# Altium project 388D_Control_v1.PrjPcb (part 1 of 3)
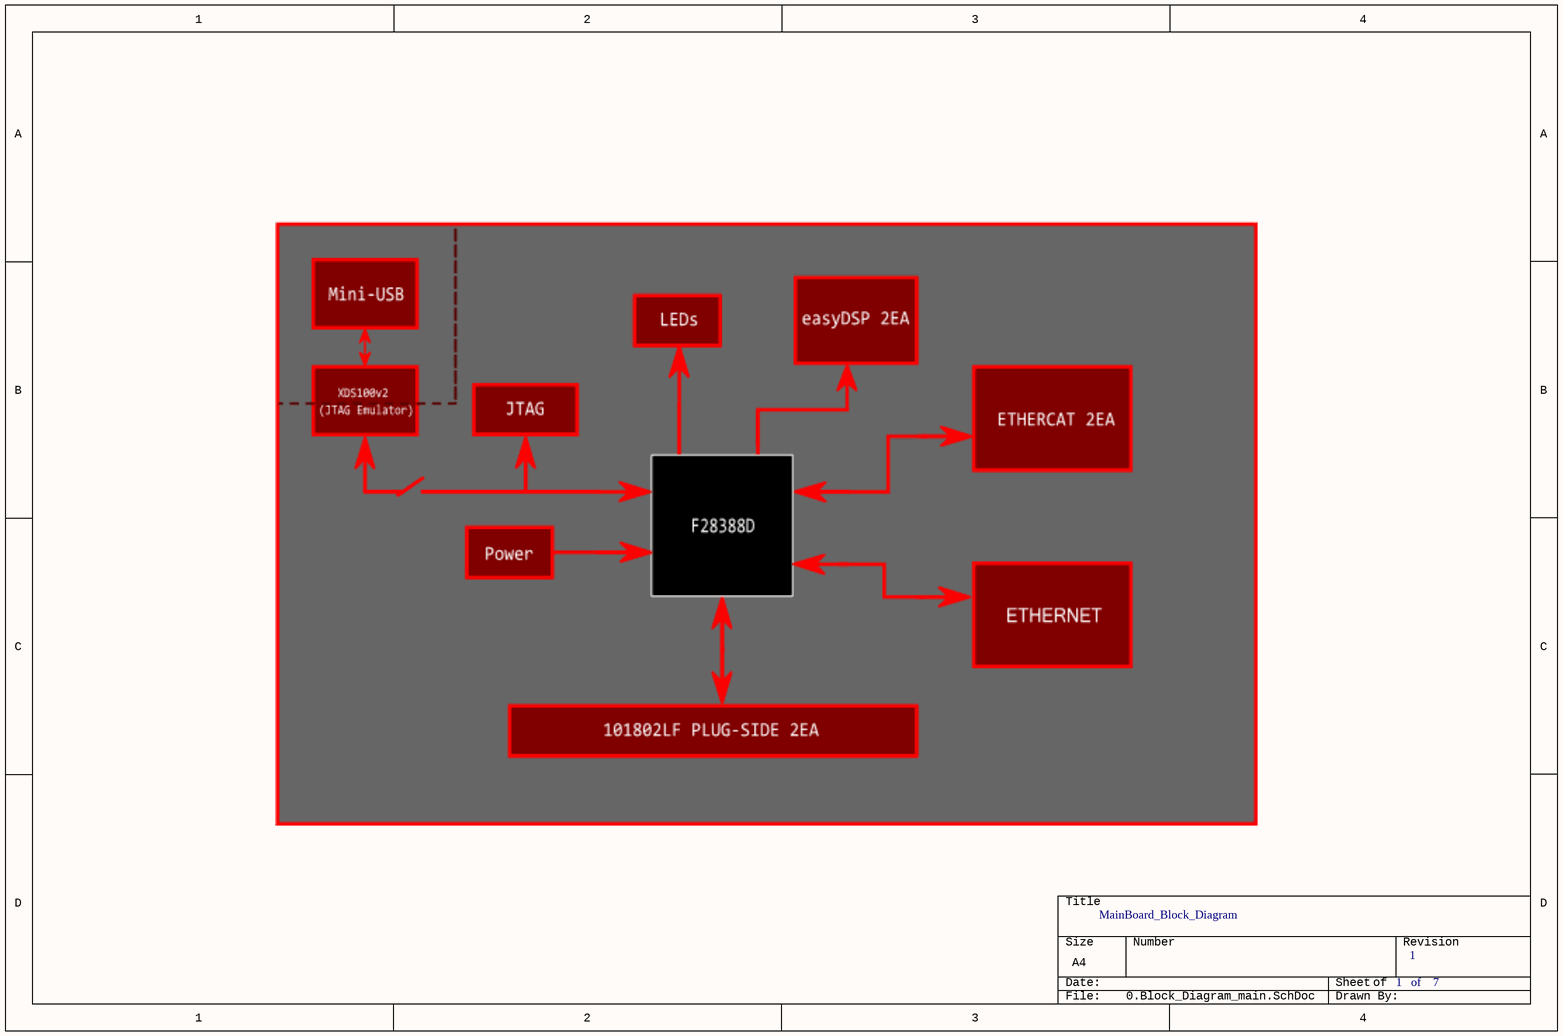
[diagram p0: 0.Block_Diagram_main.SchDoc]
10 sheets, 271 parts. Net scope: global (net labels, ports and power ports of the same name join across sheets).
Board file: 388D_Control_v1_PCB1.PcbDoc
Sheets:
  0.Block_Diagram_main.SchDoc
  1.GPIO.SchDoc
  2.Support.SchDoc
  3.ADC.SchDoc
  4.Power.SchDoc
  5.ETH.SchDoc
  6.ETCAT.SchDoc
  7.Emulator.SchDoc
  8.Emulator_Interface.SchDoc
  9.Pwm_Buffer.SchDoc

## Sheet 0.Block_Diagram_main.SchDoc
size A4; SheetNumber: 1; SheetTotal: 7

### Notes on the sheet
- LEDs
- MainBoard_Block_Diagram
- 1   of    7
- 1

## Sheet 1.GPIO.SchDoc
size A3; SheetNumber: 2; SheetTotal: 10
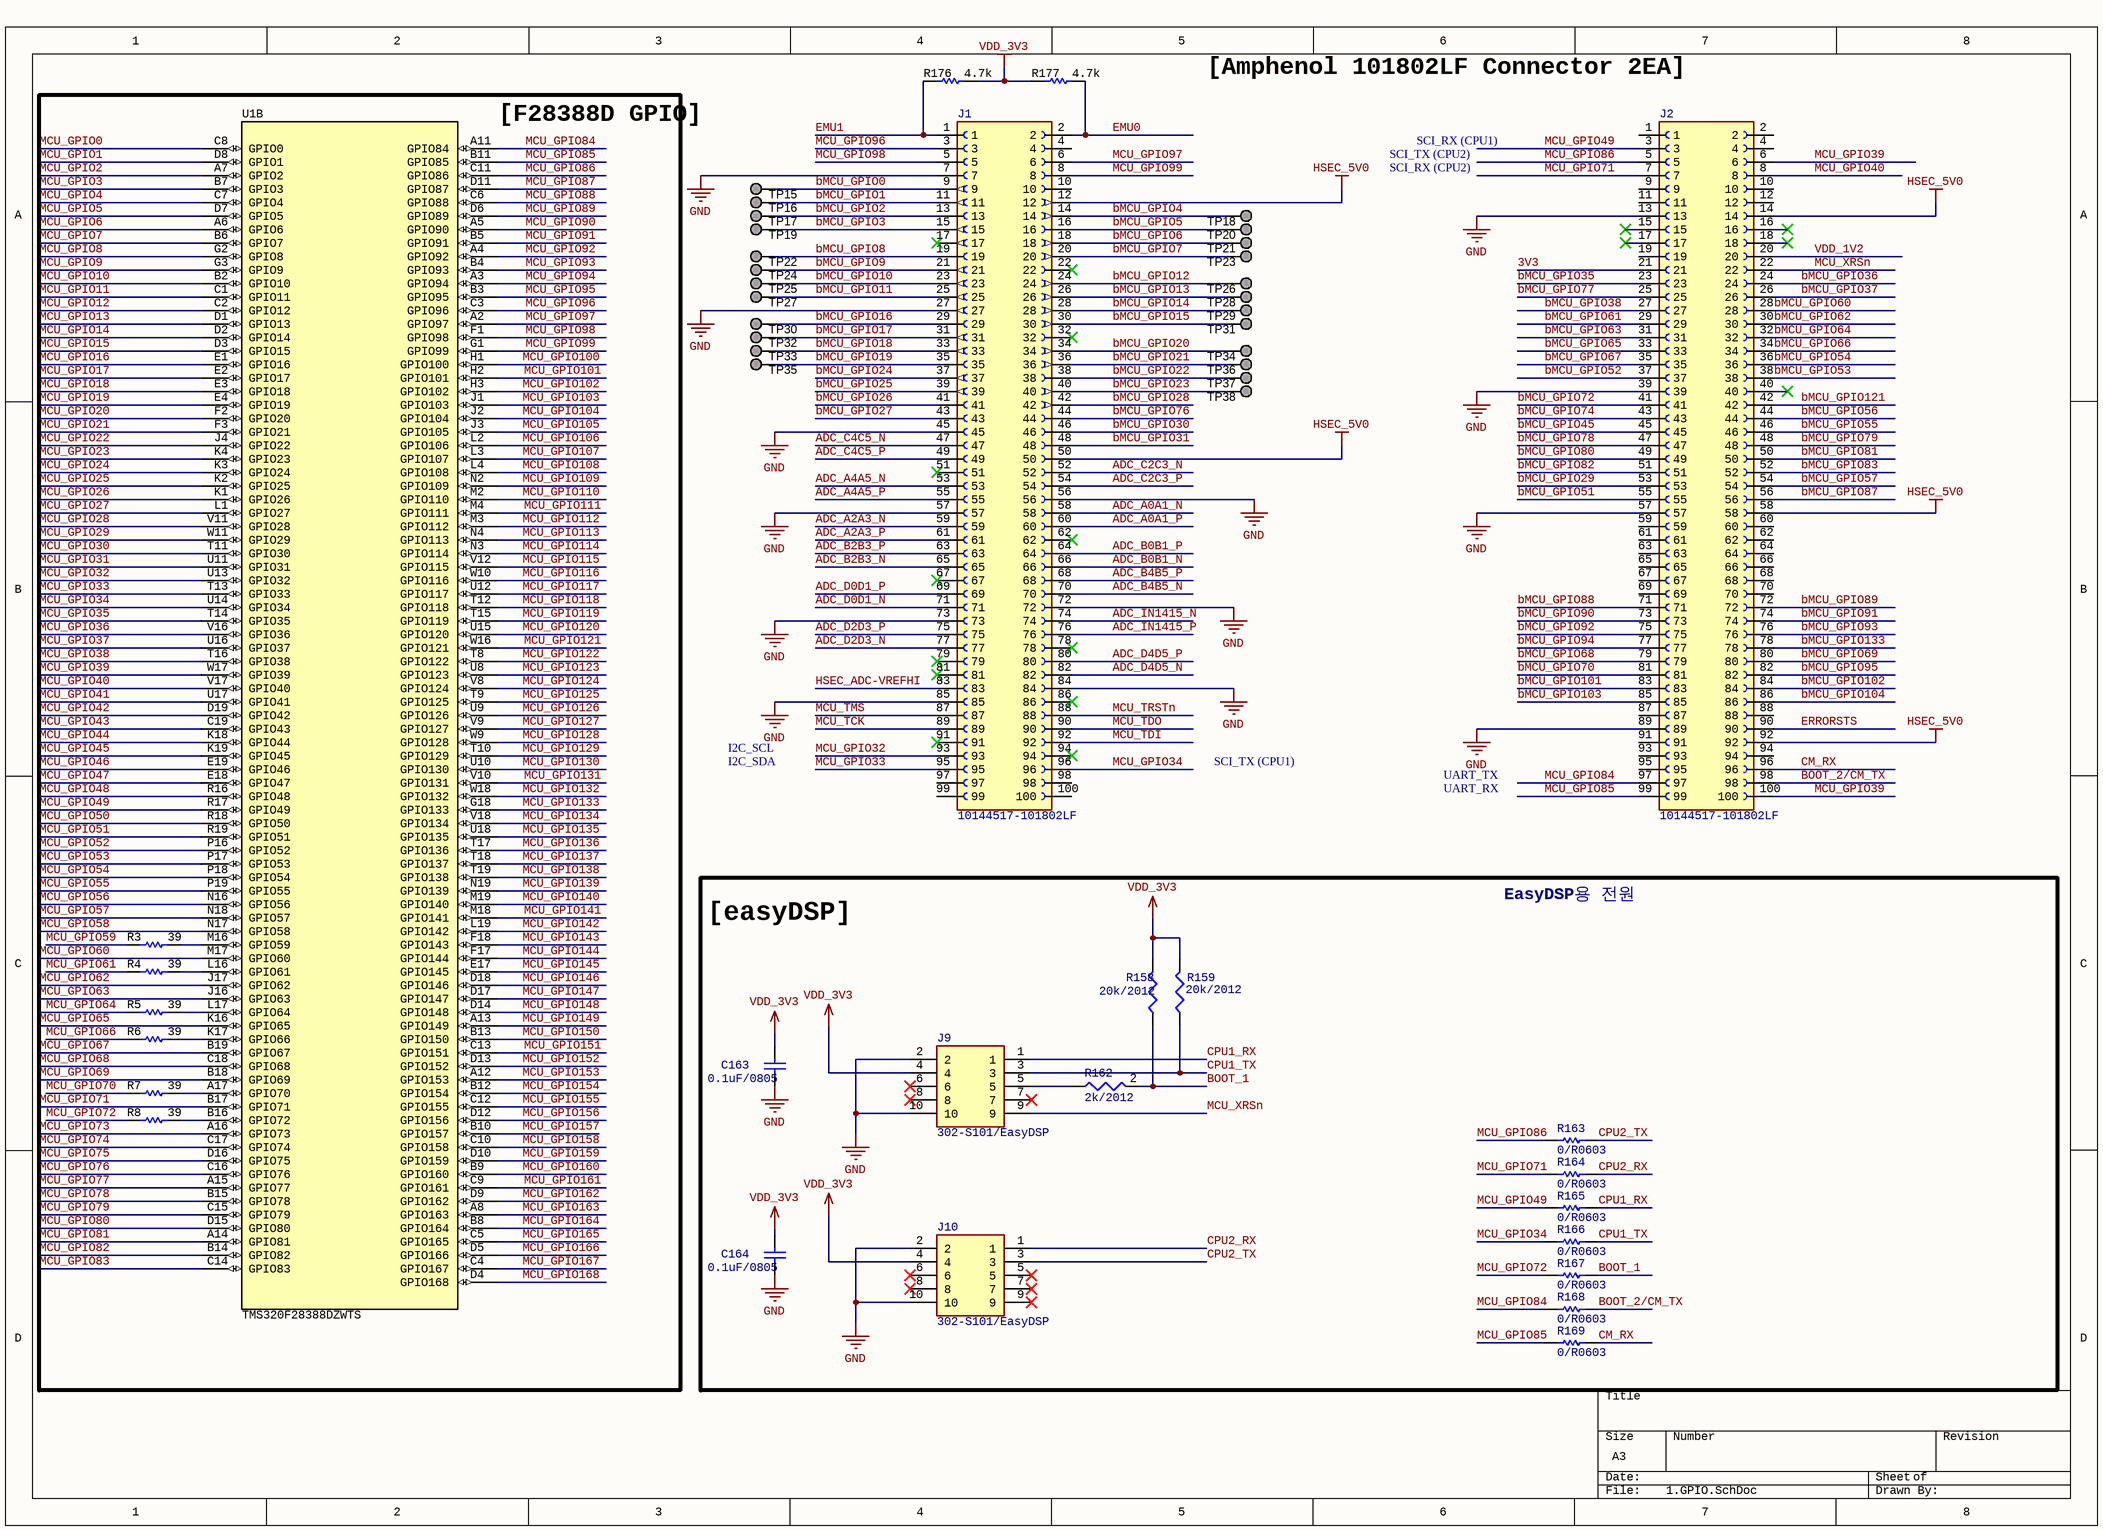
[diagram p1: 1.GPIO.SchDoc]

### Parts
(Parts that share a designator on the sheet are numbered #1, #2 ... from top to bottom, then left to right.)
C163  value 0.1uF/0805  [CAPC2013X135X45NL10T25]  (hidden comment: C2012)
C164  value 0.1uF/0805  [CAPC2013X135X45NL10T25]  (hidden comment: C2012)
J1  10144517-101802LF  [AMPHENOL_10144517-101802LF]
J2  10144517-101802LF  [AMPHENOL_10144517-101802LF]
J9  302-S101/EasyDSP  [SHDR10W66P254_2X5_2030X905X905P]
J10  302-S101/EasyDSP  [SHDR10W66P254_2X5_2030X905X905P]
R3  ValueDisplayed: 39  [0402]  (hidden comment: CRCW040239R0JNED)
R4  ValueDisplayed: 39  [0402]  (hidden comment: CRCW040239R0JNED)
R5  ValueDisplayed: 39  [0402]  (hidden comment: CRCW040239R0JNED)
R6  ValueDisplayed: 39  [0402]  (hidden comment: CRCW040239R0JNED)
R7  ValueDisplayed: 39  [0402]  (hidden comment: CRCW040239R0JNED)
R8  ValueDisplayed: 39  [0402]  (hidden comment: CRCW040239R0JNED)
R158  value 20k/2012  [RESC0805(2012)_L]  (hidden comment: R2012)
R159  value 20k/2012  [RESC0805(2012)_L]  (hidden comment: R2012)
R162  value 2k/2012  [RESC0805(2012)_L]  (hidden comment: R2012)
R163  value 0/R0603  [RESC1608X55X25ML10T15]  (hidden comment: Resistor 0R +/- 5% 0603 100 mW)
R164  value 0/R0603  [RESC1608X55X25ML10T15]  (hidden comment: Resistor 0R +/- 5% 0603 100 mW)
R165  value 0/R0603  [RESC1608X55X25ML10T15]  (hidden comment: Resistor 0R +/- 5% 0603 100 mW)
R166  value 0/R0603  [RESC1608X55X25ML10T15]  (hidden comment: Resistor 0R +/- 5% 0603 100 mW)
R167  value 0/R0603  [RESC1608X55X25ML10T15]  (hidden comment: Resistor 0R +/- 5% 0603 100 mW)
R168  value 0/R0603  [RESC1608X55X25ML10T15]  (hidden comment: Resistor 0R +/- 5% 0603 100 mW)
R169  value 0/R0603  [RESC1608X55X25ML10T15]  (hidden comment: Resistor 0R +/- 5% 0603 100 mW)
R176  ValueDisplayed: 4.7k  [0402]  (hidden comment: CRCW04024K70JNED)
R177  ValueDisplayed: 4.7k  [0402]  (hidden comment: CRCW04024K70JNED)
TP15  TESTPOINT  [TP_50MIL-25MILHOLE]  (value not drawn)  (no BOM)
TP16  TESTPOINT  [TP_50MIL-25MILHOLE]  (value not drawn)  (no BOM)
TP17  TESTPOINT  [TP_50MIL-25MILHOLE]  (value not drawn)  (no BOM)
TP18  TESTPOINT  [TP_50MIL-25MILHOLE]  (value not drawn)  (no BOM)
TP19  TESTPOINT  [TP_50MIL-25MILHOLE]  (value not drawn)  (no BOM)
TP20  TESTPOINT  [TP_50MIL-25MILHOLE]  (value not drawn)  (no BOM)
TP21  TESTPOINT  [TP_50MIL-25MILHOLE]  (value not drawn)  (no BOM)
TP22  TESTPOINT  [TP_50MIL-25MILHOLE]  (value not drawn)  (no BOM)
TP23  TESTPOINT  [TP_50MIL-25MILHOLE]  (value not drawn)  (no BOM)
TP24  TESTPOINT  [TP_50MIL-25MILHOLE]  (value not drawn)  (no BOM)
TP25  TESTPOINT  [TP_50MIL-25MILHOLE]  (value not drawn)  (no BOM)
TP26  TESTPOINT  [TP_50MIL-25MILHOLE]  (value not drawn)  (no BOM)
TP27  TESTPOINT  [TP_50MIL-25MILHOLE]  (value not drawn)  (no BOM)
TP28  TESTPOINT  [TP_50MIL-25MILHOLE]  (value not drawn)  (no BOM)
TP29  TESTPOINT  [TP_50MIL-25MILHOLE]  (value not drawn)  (no BOM)
TP30  TESTPOINT  [TP_50MIL-25MILHOLE]  (value not drawn)  (no BOM)
TP31  TESTPOINT  [TP_50MIL-25MILHOLE]  (value not drawn)  (no BOM)
TP32  TESTPOINT  [TP_50MIL-25MILHOLE]  (value not drawn)  (no BOM)
TP33  TESTPOINT  [TP_50MIL-25MILHOLE]  (value not drawn)  (no BOM)
TP34  TESTPOINT  [TP_50MIL-25MILHOLE]  (value not drawn)  (no BOM)
TP35  TESTPOINT  [TP_50MIL-25MILHOLE]  (value not drawn)  (no BOM)
TP36  TESTPOINT  [TP_50MIL-25MILHOLE]  (value not drawn)  (no BOM)
TP37  TESTPOINT  [TP_50MIL-25MILHOLE]  (value not drawn)  (no BOM)
TP38  TESTPOINT  [TP_50MIL-25MILHOLE]  (value not drawn)  (no BOM)
U1#1  TMS320F28388DZWTS  [ZWT0337A-IPC_B]  (part B of 5)

### Blocks framed on the sheet
[F28388D GPIO]: R3-R8 U1#1
[easyDSP]: C163 C164 J9 J10 R158 R159 R162-R169

### Nets
3V3: J2.21
GND: C163.2 C164.2 J1.7 J1.27 J1.45 J1.56 J1.57 J1.72 J1.73 J1.84 J1.85 J2.13 J2.39 J2.57 J2.89 J9.2 J9.10 J10.2 J10.10
HSEC_5V0: J1.12 J1.50 J2.14 J2.58 J2.92
VDD_1V2: J2.20
VDD_3V3: C163.1 C164.1 J9.4 J10.4 R158.2 R159.2 R176.2 R177.1
ADC_A0A1_N: J1.58
ADC_A0A1_P: J1.60
ADC_A2A3_N: J1.59
ADC_A2A3_P: J1.61
ADC_A4A5_N: J1.53
ADC_A4A5_P: J1.55
ADC_B0B1_N: J1.66
ADC_B0B1_P: J1.64
ADC_B2B3_N: J1.65
ADC_B2B3_P: J1.63
ADC_B4B5_N: J1.70
ADC_B4B5_P: J1.68
ADC_C2C3_N: J1.52
ADC_C2C3_P: J1.54
ADC_C4C5_N: J1.47
ADC_C4C5_P: J1.49
ADC_D0D1_N: J1.71
ADC_D0D1_P: J1.69
ADC_D2D3_N: J1.77
ADC_D2D3_P: J1.75
ADC_D4D5_N: J1.82
ADC_D4D5_P: J1.80
ADC_IN1415_N: J1.74
ADC_IN1415_P: J1.76
bMCU_GPIO0: J1.9 TP15.1
bMCU_GPIO1: J1.11 TP16.1
bMCU_GPIO2: J1.13 TP17.1
bMCU_GPIO3: J1.15 TP19.1
bMCU_GPIO4: J1.14 TP18.1
bMCU_GPIO5: J1.16 TP20.1
bMCU_GPIO6: J1.18 TP21.1
bMCU_GPIO7: J1.20 TP23.1
bMCU_GPIO8: J1.19 TP22.1
bMCU_GPIO9: J1.21 TP24.1
bMCU_GPIO10: J1.23 TP25.1
bMCU_GPIO11: J1.25 TP27.1
bMCU_GPIO12: J1.24 TP26.1
bMCU_GPIO13: J1.26 TP28.1
bMCU_GPIO14: J1.28 TP29.1
bMCU_GPIO15: J1.30 TP31.1
bMCU_GPIO16: J1.29 TP30.1
bMCU_GPIO17: J1.31 TP32.1
bMCU_GPIO18: J1.33 TP33.1
bMCU_GPIO19: J1.35 TP35.1
bMCU_GPIO20: J1.34 TP34.1
bMCU_GPIO21: J1.36 TP36.1
bMCU_GPIO22: J1.38 TP37.1
bMCU_GPIO23: J1.40 TP38.1
bMCU_GPIO24: J1.37
bMCU_GPIO25: J1.39
bMCU_GPIO26: J1.41
bMCU_GPIO27: J1.43
bMCU_GPIO28: J1.42
bMCU_GPIO29: J2.53
bMCU_GPIO30: J1.46
bMCU_GPIO31: J1.48
bMCU_GPIO35: J2.23
bMCU_GPIO36: J2.24
bMCU_GPIO37: J2.26
bMCU_GPIO38: J2.27
bMCU_GPIO45: J2.45
bMCU_GPIO51: J2.55
bMCU_GPIO52: J2.37
bMCU_GPIO53: J2.38
bMCU_GPIO54: J2.36
bMCU_GPIO55: J2.46
bMCU_GPIO56: J2.44
bMCU_GPIO57: J2.54
bMCU_GPIO60: J2.28
bMCU_GPIO61: J2.29
bMCU_GPIO62: J2.30
bMCU_GPIO63: J2.31
bMCU_GPIO64: J2.32
bMCU_GPIO65: J2.33
bMCU_GPIO66: J2.34
bMCU_GPIO67: J2.35
bMCU_GPIO68: J2.79
bMCU_GPIO69: J2.80
bMCU_GPIO70: J2.81
bMCU_GPIO72: J2.41
bMCU_GPIO74: J2.43
bMCU_GPIO76: J1.44
bMCU_GPIO77: J2.25
bMCU_GPIO78: J2.47
bMCU_GPIO79: J2.48
bMCU_GPIO80: J2.49
bMCU_GPIO81: J2.50
bMCU_GPIO82: J2.51
bMCU_GPIO83: J2.52
bMCU_GPIO87: J2.56
bMCU_GPIO88: J2.71
bMCU_GPIO89: J2.72
bMCU_GPIO90: J2.73
bMCU_GPIO91: J2.74
bMCU_GPIO92: J2.75
bMCU_GPIO93: J2.76
bMCU_GPIO94: J2.77
bMCU_GPIO95: J2.82
bMCU_GPIO101: J2.83
bMCU_GPIO102: J2.84
bMCU_GPIO103: J2.85
bMCU_GPIO104: J2.86
bMCU_GPIO121: J2.42
bMCU_GPIO133: J2.78
BOOT_1: R158.1 R162.2 R167.2
BOOT_2/CM_TX: J2.98 R168.2
CM_RX: J2.96 R169.2
CPU1_RX: J9.1 R165.2
CPU1_TX: J9.3 R159.1 R166.2
CPU2_RX: J10.1 R164.2
CPU2_TX: J10.3 R163.2
EMU0: J1.2 R177.2
EMU1: J1.1 R176.1
ERRORSTS: J2.90
HSEC_ADC-VREFHI: J1.83
MCU_GPIO0: U1#1.C8(GPIO0)
MCU_GPIO1: U1#1.D8(GPIO1)
MCU_GPIO2: U1#1.A7(GPIO2)
MCU_GPIO3: U1#1.B7(GPIO3)
MCU_GPIO4: U1#1.C7(GPIO4)
MCU_GPIO5: U1#1.D7(GPIO5)
MCU_GPIO6: U1#1.A6(GPIO6)
MCU_GPIO7: U1#1.B6(GPIO7)
MCU_GPIO8: U1#1.G2(GPIO8)
MCU_GPIO9: U1#1.G3(GPIO9)
MCU_GPIO10: U1#1.B2(GPIO10)
MCU_GPIO11: U1#1.C1(GPIO11)
MCU_GPIO12: U1#1.C2(GPIO12)
MCU_GPIO13: U1#1.D1(GPIO13)
MCU_GPIO14: U1#1.D2(GPIO14)
MCU_GPIO15: U1#1.D3(GPIO15)
MCU_GPIO16: U1#1.E1(GPIO16)
MCU_GPIO17: U1#1.E2(GPIO17)
MCU_GPIO18: U1#1.E3(GPIO18)
MCU_GPIO19: U1#1.E4(GPIO19)
MCU_GPIO20: U1#1.F2(GPIO20)
MCU_GPIO21: U1#1.F3(GPIO21)
MCU_GPIO22: U1#1.J4(GPIO22)
MCU_GPIO23: U1#1.K4(GPIO23)
MCU_GPIO24: U1#1.K3(GPIO24)
MCU_GPIO25: U1#1.K2(GPIO25)
MCU_GPIO26: U1#1.K1(GPIO26)
MCU_GPIO27: U1#1.L1(GPIO27)
MCU_GPIO28: U1#1.V11(GPIO28)
MCU_GPIO29: U1#1.W11(GPIO29)
MCU_GPIO30: U1#1.T11(GPIO30)
MCU_GPIO31: U1#1.U11(GPIO31)
MCU_GPIO32: J1.93 U1#1.U13(GPIO32)
MCU_GPIO33: J1.95 U1#1.T13(GPIO33)
MCU_GPIO34: J1.96 R166.1 U1#1.U14(GPIO34)
MCU_GPIO35: U1#1.T14(GPIO35)
MCU_GPIO36: U1#1.V16(GPIO36)
MCU_GPIO37: U1#1.U16(GPIO37)
MCU_GPIO38: U1#1.T16(GPIO38)
MCU_GPIO39: J2.6 J2.100 U1#1.W17(GPIO39)
MCU_GPIO40: J2.8 U1#1.V17(GPIO40)
MCU_GPIO41: U1#1.U17(GPIO41)
MCU_GPIO42: U1#1.D19(GPIO42)
MCU_GPIO43: U1#1.C19(GPIO43)
MCU_GPIO44: U1#1.K18(GPIO44)
MCU_GPIO45: U1#1.K19(GPIO45)
MCU_GPIO46: U1#1.E19(GPIO46)
MCU_GPIO47: U1#1.E18(GPIO47)
MCU_GPIO48: U1#1.R16(GPIO48)
MCU_GPIO49: J2.3 R165.1 U1#1.R17(GPIO49)
MCU_GPIO50: U1#1.R18(GPIO50)
MCU_GPIO51: U1#1.R19(GPIO51)
MCU_GPIO52: U1#1.P16(GPIO52)
MCU_GPIO53: U1#1.P17(GPIO53)
MCU_GPIO54: U1#1.P18(GPIO54)
MCU_GPIO55: U1#1.P19(GPIO55)
MCU_GPIO56: U1#1.N16(GPIO56)
MCU_GPIO57: U1#1.N18(GPIO57)
MCU_GPIO58: U1#1.N17(GPIO58)
MCU_GPIO59: R3.1
MCU_GPIO60: U1#1.M17(GPIO60)
MCU_GPIO61: R4.1
MCU_GPIO62: U1#1.J17(GPIO62)
MCU_GPIO63: U1#1.J16(GPIO63)
MCU_GPIO64: R5.1
MCU_GPIO65: U1#1.K16(GPIO65)
MCU_GPIO66: R6.1
MCU_GPIO67: U1#1.B19(GPIO67)
MCU_GPIO68: U1#1.C18(GPIO68)
MCU_GPIO69: U1#1.B18(GPIO69)
MCU_GPIO70: R7.1
MCU_GPIO71: J2.7 R164.1 U1#1.B17(GPIO71)
MCU_GPIO72: R8.1 R167.1
MCU_GPIO73: U1#1.A16(GPIO73)
MCU_GPIO74: U1#1.C17(GPIO74)
MCU_GPIO75: U1#1.D16(GPIO75)
MCU_GPIO76: U1#1.C16(GPIO76)
MCU_GPIO77: U1#1.A15(GPIO77)
MCU_GPIO78: U1#1.B15(GPIO78)
MCU_GPIO79: U1#1.C15(GPIO79)
MCU_GPIO80: U1#1.D15(GPIO80)
MCU_GPIO81: U1#1.A14(GPIO81)
MCU_GPIO82: U1#1.B14(GPIO82)
MCU_GPIO83: U1#1.C14(GPIO83)
MCU_GPIO84: J2.97 R168.1 U1#1.A11(GPIO84)
MCU_GPIO85: J2.99 R169.1 U1#1.B11(GPIO85)
MCU_GPIO86: J2.5 R163.1 U1#1.C11(GPIO86)
MCU_GPIO87: U1#1.D11(GPIO87)
MCU_GPIO88: U1#1.C6(GPIO88)
MCU_GPIO89: U1#1.D6(GPIO89)
MCU_GPIO90: U1#1.A5(GPIO90)
MCU_GPIO91: U1#1.B5(GPIO91)
MCU_GPIO92: U1#1.A4(GPIO92)
MCU_GPIO93: U1#1.B4(GPIO93)
MCU_GPIO94: U1#1.A3(GPIO94)
MCU_GPIO95: U1#1.B3(GPIO95)
MCU_GPIO96: J1.3 U1#1.C3(GPIO96)
MCU_GPIO97: J1.6 U1#1.A2(GPIO97)
MCU_GPIO98: J1.5 U1#1.F1(GPIO98)
MCU_GPIO99: J1.8 U1#1.G1(GPIO99)
MCU_GPIO100: U1#1.H1(GPIO100)
MCU_GPIO101: U1#1.H2(GPIO101)
MCU_GPIO102: U1#1.H3(GPIO102)
MCU_GPIO103: U1#1.J1(GPIO103)
MCU_GPIO104: U1#1.J2(GPIO104)
MCU_GPIO105: U1#1.J3(GPIO105)
MCU_GPIO106: U1#1.L2(GPIO106)
MCU_GPIO107: U1#1.L3(GPIO107)
MCU_GPIO108: U1#1.L4(GPIO108)
MCU_GPIO109: U1#1.N2(GPIO109)
MCU_GPIO110: U1#1.M2(GPIO110)
MCU_GPIO111: U1#1.M4(GPIO111)
MCU_GPIO112: U1#1.M3(GPIO112)
MCU_GPIO113: U1#1.N4(GPIO113)
MCU_GPIO114: U1#1.N3(GPIO114)
MCU_GPIO115: U1#1.V12(GPIO115)
MCU_GPIO116: U1#1.W10(GPIO116)
MCU_GPIO117: U1#1.U12(GPIO117)
MCU_GPIO118: U1#1.T12(GPIO118)
MCU_GPIO119: U1#1.T15(GPIO119)
MCU_GPIO120: U1#1.U15(GPIO120)
MCU_GPIO121: U1#1.W16(GPIO121)
MCU_GPIO122: U1#1.T8(GPIO122)
MCU_GPIO123: U1#1.U8(GPIO123)
MCU_GPIO124: U1#1.V8(GPIO124)
MCU_GPIO125: U1#1.T9(GPIO125)
MCU_GPIO126: U1#1.U9(GPIO126)
MCU_GPIO127: U1#1.V9(GPIO127)
MCU_GPIO128: U1#1.W9(GPIO128)
MCU_GPIO129: U1#1.T10(GPIO129)
MCU_GPIO130: U1#1.U10(GPIO130)
MCU_GPIO131: U1#1.V10(GPIO131)
MCU_GPIO132: U1#1.W18(GPIO132)
MCU_GPIO133: U1#1.G18(GPIO133)
MCU_GPIO134: U1#1.V18(GPIO134)
MCU_GPIO135: U1#1.U18(GPIO135)
MCU_GPIO136: U1#1.T17(GPIO136)
MCU_GPIO137: U1#1.T18(GPIO137)
MCU_GPIO138: U1#1.T19(GPIO138)
MCU_GPIO139: U1#1.N19(GPIO139)
MCU_GPIO140: U1#1.M19(GPIO140)
MCU_GPIO141: U1#1.M18(GPIO141)
MCU_GPIO142: U1#1.L19(GPIO142)
MCU_GPIO143: U1#1.F18(GPIO143)
MCU_GPIO144: U1#1.F17(GPIO144)
MCU_GPIO145: U1#1.E17(GPIO145)
MCU_GPIO146: U1#1.D18(GPIO146)
MCU_GPIO147: U1#1.D17(GPIO147)
MCU_GPIO148: U1#1.D14(GPIO148)
MCU_GPIO149: U1#1.A13(GPIO149)
MCU_GPIO150: U1#1.B13(GPIO150)
MCU_GPIO151: U1#1.C13(GPIO151)
MCU_GPIO152: U1#1.D13(GPIO152)
MCU_GPIO153: U1#1.A12(GPIO153)
MCU_GPIO154: U1#1.B12(GPIO154)
MCU_GPIO155: U1#1.C12(GPIO155)
MCU_GPIO156: U1#1.D12(GPIO156)
MCU_GPIO157: U1#1.B10(GPIO157)
MCU_GPIO158: U1#1.C10(GPIO158)
MCU_GPIO159: U1#1.D10(GPIO159)
MCU_GPIO160: U1#1.B9(GPIO160)
MCU_GPIO161: U1#1.C9(GPIO161)
MCU_GPIO162: U1#1.D9(GPIO162)
MCU_GPIO163: U1#1.A8(GPIO163)
MCU_GPIO164: U1#1.B8(GPIO164)
MCU_GPIO165: U1#1.C5(GPIO165)
MCU_GPIO166: U1#1.D5(GPIO166)
MCU_GPIO167: U1#1.C4(GPIO167)
MCU_GPIO168: U1#1.D4(GPIO168)
MCU_TCK: J1.89
MCU_TDI: J1.92
MCU_TDO: J1.90
MCU_TMS: J1.87
MCU_TRSTn: J1.88
MCU_XRSn: J2.22 J9.9
NetJ9_5: J9.5 R162.1
NetR3_2: R3.2 U1#1.M16(GPIO59)
NetR4_2: R4.2 U1#1.L16(GPIO61)
NetR5_2: R5.2 U1#1.L17(GPIO64)
NetR6_2: R6.2 U1#1.K17(GPIO66)
NetR7_2: R7.2 U1#1.A17(GPIO70)
NetR8_2: R8.2 U1#1.B16(GPIO72)

Not connected (* = marked no-connect by the designer): J1 4 10 17* 22* 32* 51* 62* 67* 78* 79* 81* 86* 91* 94* 97 98 99 100; J2 1 2 4 9 10 11 12 15* 16* 17* 18* 19 40* 59 60 61 62 63 64 65 66 67 68 69 70 87 88 91 93 94 95; J9 6* 7* 8*; J10 5* 6* 7* 8* 9*

### Notes on the sheet
- [Amphenol 101802LF Connector 2EA]
- SCI_TX (CPU2)
- SCI_RX (CPU2)
- SCI_RX (CPU1)
- I2C_SCL
- I2C_SDA
- SCI_TX (CPU1)
- UART_RX
- UART_TX
- EasyDSP용 전원

### Library data of the parts
C163 C164 = CMP-001-00007-7: Chip Capacitor, 1 uF, +/- 10%, 50 V, 0805 (2012 Metric); Voltage Rating: 50V; Capacitor Type: Ceramic; Case/Package: 0805; Min Operating Temperature: -55°C; Max Operating Temperature: 125°C; Pins: 2; Tolerance: 10%; RoHS Compliant: True; Mounting Technology: SM
J1 J2 = CMP-002-00178-1: Socket(male) 100 Positions, Dual Row, Vertical Receptacle. BergStak Lite 0.80mm, Board-to-Board Connector,; MF: AMPHENOL ICC / FCI; Source: SamacSys.SchLib; Check_prices: https://www.snapeda.com/parts/10144517-101802LF/Amphenol/view-part/?ref=eda; Value: *; Case/Package: None; MP: 10144517-101802LF; Design Item ID: 10144517-101802LF; SnapEDA_Link: https://www.snapeda.com/parts/10144517-101802LF/Amphenol/view-part/?ref=snap
J9 J10 = CMP-002-00158-1: 10 Positions Header Connector 0.100" (2.54mm) Through Hole Gold; Manufacturer_Name: On Shore Technology Inc.; Design Item ID: 302-S101; Manufacturer_Part_Number: 302-S101; Arrow Part Number: 302-S101; Datasheet Link: https://www.digikey.com/product-detail/en/on-shore-technology-inc/302-S101/ED1543-ND/2178422; Source: SamacSys.SchLib; Arrow Price/Stock: https://www.arrow.com/en/products/302-s101/on-shore-technology?utm_currency=USD&region=nac; Height: 9.05mm
R3-R8 = CMP-0026916-3: RES, 39, 5%, 0.063 W, AEC-Q200 Grade 0, 0402; Manufacturer: Vishay-Dale; Power_W: 63mW; TempCo: 200 ppm/C; Value_Code: 39R0; Value: 39; EIA_Code: E24; SizeX_mm: 1; SizeY_mm: 0.5; SizeZ_mm: 0.6; Value2: 0.063W; AEC Qualified: Y; VDC_V: 50V; AEC Category: Q200; AEC Grade: 0; Supplier Part Number 2: 89M6649; Supplier 2: Newark; Supplier Part Number 3: 71-CRCW0402J-39-E3; Supplier 3: Mouser; RoHS: E; Value1: 5%; MountType: SMT; Supplier 1: Digi-Key; PackageReference: 0402; Tolerance_%: 5%; Res_ohm: 39; SizeArea_mm2: 0.5; CompType: Resistor; PartNumber: CRCW040239R0JNED; ComponentLink1Description: Datasheet link; Supplier Part Number 1: 541-39JCT-ND; Technology: Thick Film; ComponentLink1URL: http://www.vishay.com/docs/20035/dcrcwe3.pdf
R158 R159 R162 = CMP-009-00174-4: Chip Resistor, 4,7 Ohms, +/-5 %, 125 mW, -55 to 155 degC, 0805; Power: 125mW; Tolerance: 5%; Max Operating Temperature: 155°C; Pins: 2; Case/Package: 0805; Min Operating Temperature: -55°C
R163-R169 = CMP-009-00006-5: Chip Resistor, 0 Ohm, 0.1 W, -55 to 155 degC, 0603 (1608 Metric); Power: 100mW; Voltage Rating: 50V; Max Operating Temperature: 155°C; RoHS Compliant: True; Mounting Technology: SM; Case/Package: 0603; Min Operating Temperature: -55°C; Tolerance: 5%; Pins: 2
R176 R177 = CMP-0026938-5: RES, 4.7 k, 5%, 0.063 W, AEC-Q200 Grade 0, 0402; Manufacturer: Vishay-Dale; Power_W: 63mW; TempCo: 200 ppm/C; Value_Code: 4k70; Value: 4.7k; EIA_Code: E24; SizeX_mm: 1; SizeY_mm: 0.5; SizeZ_mm: 0.6; Value2: 0.063W; AEC Qualified: Y; VDC_V: 50V; AEC Category: Q200; AEC Grade: 0; Supplier Part Number 2: 59M6733; Supplier 2: Newark; Supplier Part Number 3: 71-CRCW0402J-4.7K-E3; Supplier 3: Mouser; RoHS: E; Value1: 5%; MountType: SMT; Supplier 1: Digi-Key; PackageReference: 0402; Tolerance_%: 5%; Res_ohm: 4.7k; SizeArea_mm2: 0.5; CompType: Resistor; PartNumber: CRCW04024K70JNED; ComponentLink1Description: Datasheet link; Supplier Part Number 1: 541-4.7KJCT-ND; Technology: Thick Film; ComponentLink1URL: http://www.vishay.com/docs/20035/dcrcwe3.pdf
TP15-TP38 = CMP-0078143-3: TEST POINT.  No entry in BOM.; CompType: Testpoint; PackageReference: N/A; Manufacturer: N/A; PartNumber: N/A; Library Reference: TESTPOINT
U1#1 = CMP-012-000147-1: TMS320F28388DZWTS, ZWT0337A (NFBGA-337); Manufacturer: Texas Instruments; SizeAreaWB_mm2: 324; SizeArea_mm2: 256; AEC Qualified: N; AEC Category: Q200; SizeZ_mm: 1.4; SizeY_mm: 16; CompType: IC; Available Preview Images: 2D; ComponentLink1Description: Datasheet Link; ComponentLink2Description: Product Folder; PackageReference: ZWT0337A; PartNumber: TMS320F28388DZWTS; PackageDescription: NFBGA-337; ComponentLink2URL: http://www.ti.com/product/tms320f28388d; Alternate Manufacturer: Texas Instruments; ComponentLink3URL: http://www.ti.com/product/tms320f28388d/datasheet; ComponentLink1URL: http://www.ti.com/lit/ds/symlink/tms320f28388d.pdf; MountType: SMT; ComponentLink3Description: Online Datasheet; SizeX_mm: 16; Design Item ID: TMS320F28388DZWTS; Source: SamacSys.SchLib

## Sheet 2.Support.SchDoc
size A3; SheetNumber: 3; SheetTotal: 10
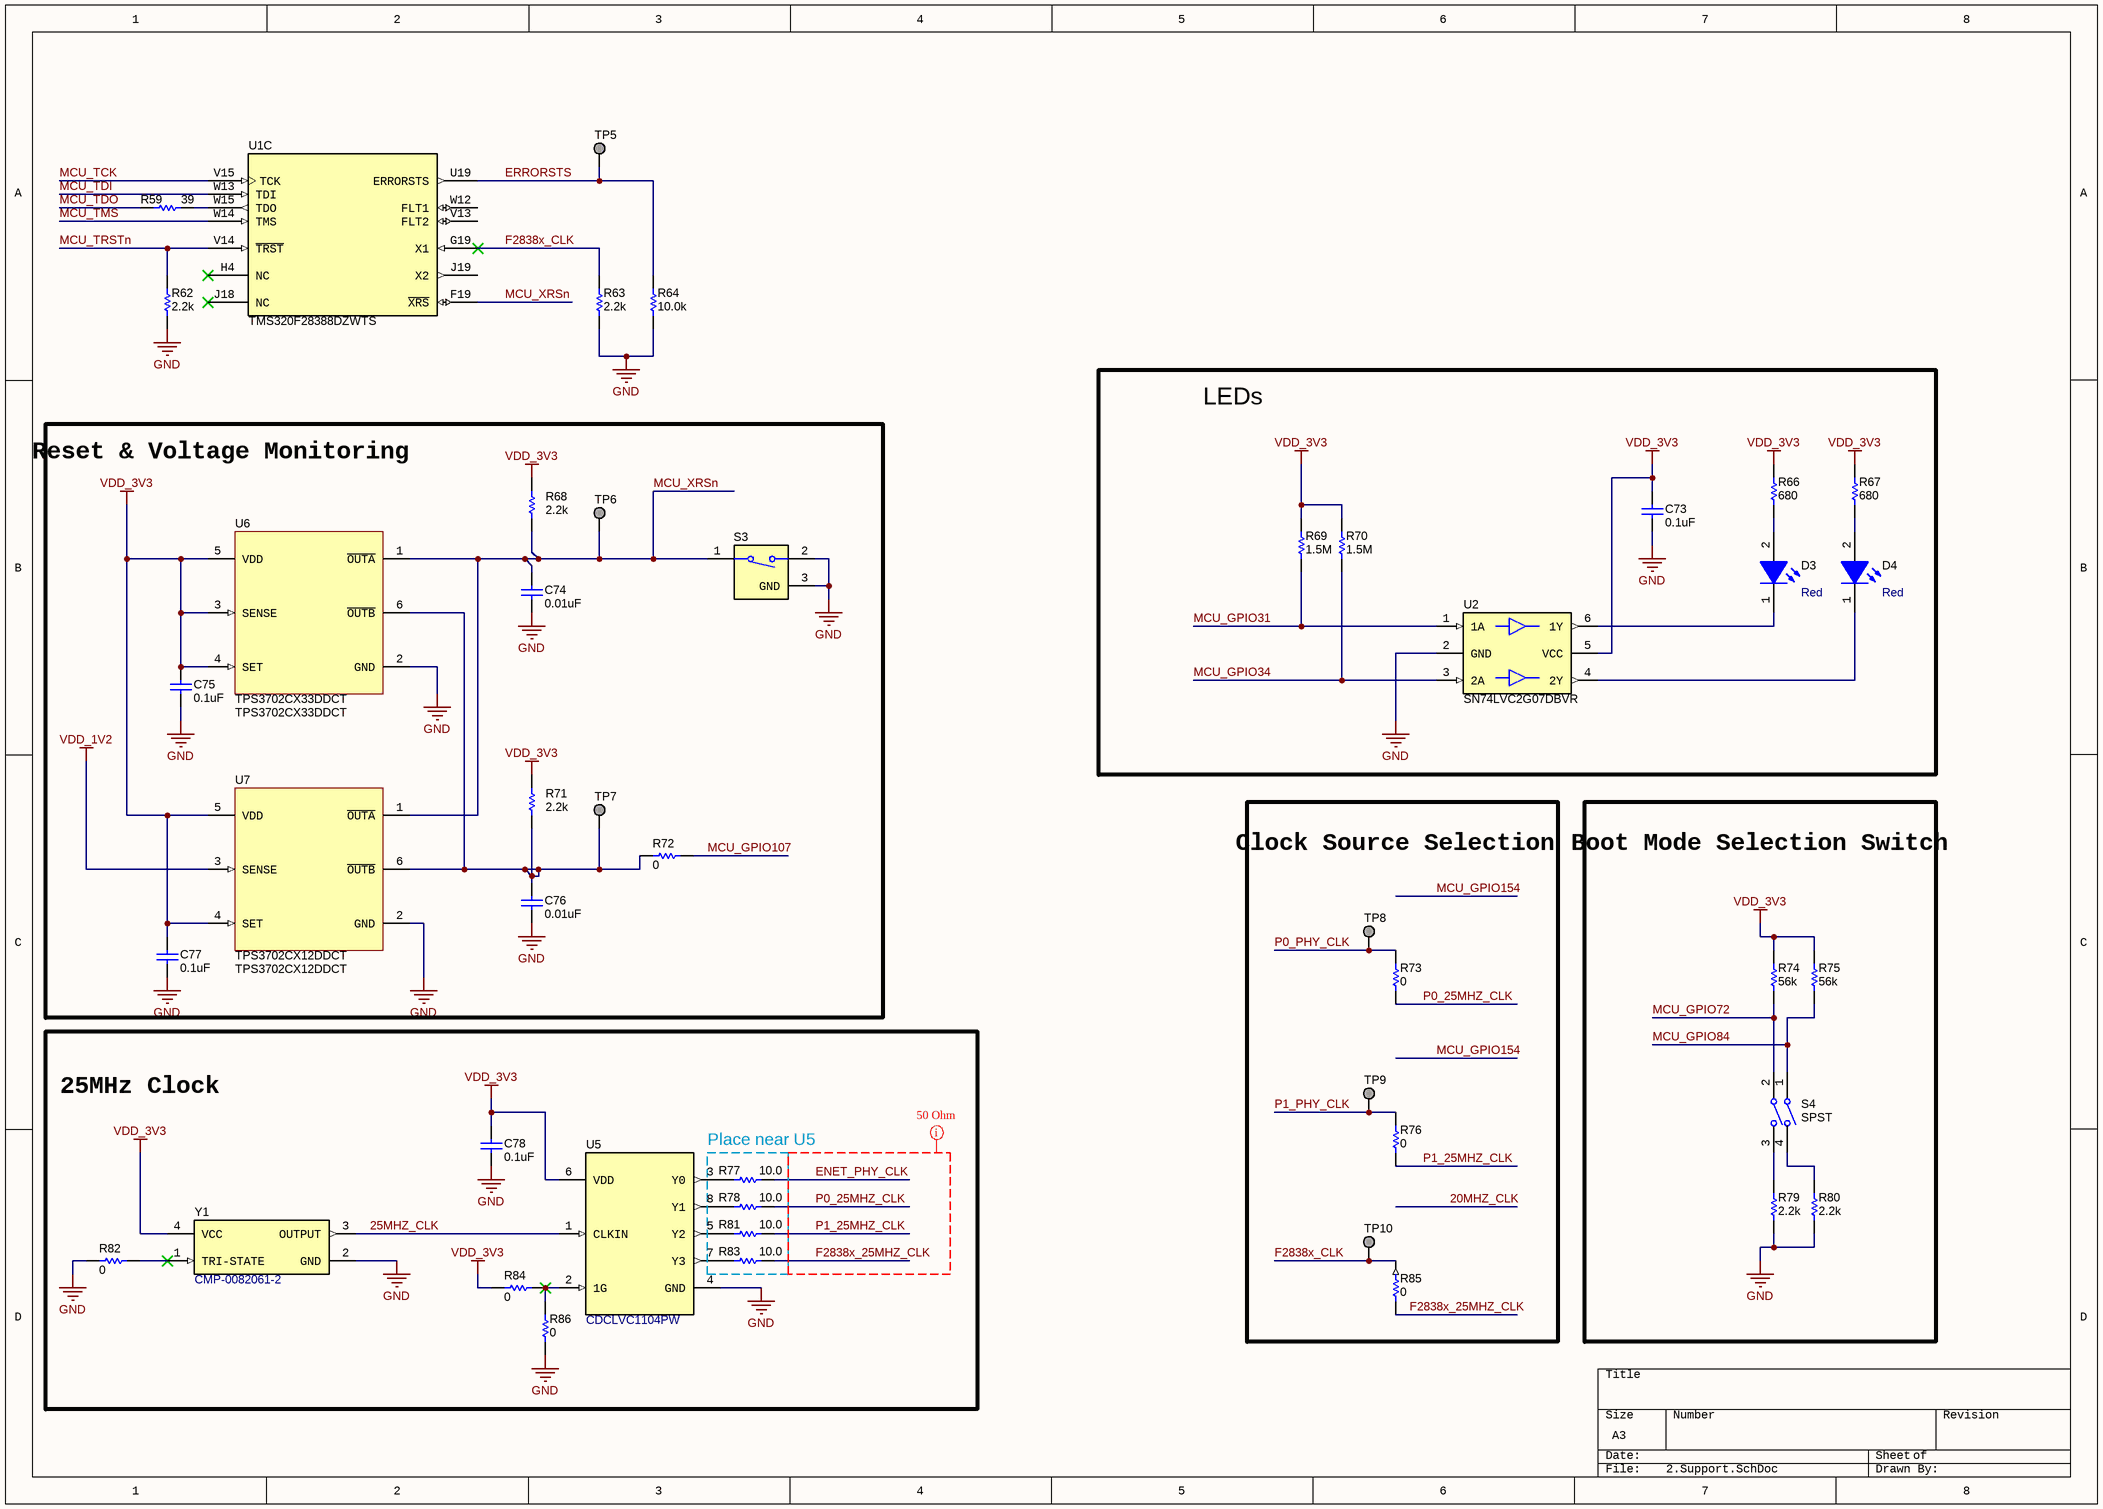
[diagram p2: 2.Support.SchDoc]

### Parts
(Parts that share a designator on the sheet are numbered #1, #2 ... from top to bottom, then left to right.)
C73  ValueDisplayed: 0.1uF  [0402]  (hidden comment: CL05B104KP5NNNC)
C74  ValueDisplayed: 0.01uF  [0402]  (hidden comment: C0402C103J5RACTU)
C75  ValueDisplayed: 0.1uF  [0402]  (hidden comment: CL05B104KP5NNNC)
C76  ValueDisplayed: 0.01uF  [0402]  (hidden comment: C0402C103J5RACTU)
C77  ValueDisplayed: 0.1uF  [0402]  (hidden comment: CL05B104KP5NNNC)
C78  ValueDisplayed: 0.1uF  [0402]  (hidden comment: CL05B104KP5NNNC)
D3  value Red  [WL-SMCW_RED_0805]  (hidden comment: 150080SS75000)
D4  value Red  [WL-SMCW_RED_0805]  (hidden comment: 150080SS75000)
R59  ValueDisplayed: 39  [0402]  (hidden comment: CRCW040239R0JNED)
R62  ValueDisplayed: 2.2k  [0402]  (hidden comment: CRCW04022K20JNED)
R63  ValueDisplayed: 2.2k  [0402]  (hidden comment: CRCW04022K20JNED)
R64  ValueDisplayed: 10.0k  [0402]  (hidden comment: RC0402FR-0710KL)
R66  ValueDisplayed: 680  [0402]  (hidden comment: CRCW0402680RJNED)
R67  ValueDisplayed: 680  [0402]  (hidden comment: CRCW0402680RJNED)
R68  ValueDisplayed: 2.2k  [0402]  (hidden comment: CRCW04022K20JNED)
R69  ValueDisplayed: 1.5M  [0402]  (hidden comment: CRCW04021M50JNED)
R70  ValueDisplayed: 1.5M  [0402]  (hidden comment: CRCW04021M50JNED)
R71  ValueDisplayed: 2.2k  [0402]  (hidden comment: CRCW04022K20JNED)
R72  ValueDisplayed: 0  [0603]  (hidden comment: CRCW06030000Z0EA)
R73  ValueDisplayed: 0  [0603]  (hidden comment: CRCW06030000Z0EA)
R74  ValueDisplayed: 56k  [0402]  (hidden comment: CRCW040256K0JNED)
R75  ValueDisplayed: 56k  [0402]  (hidden comment: CRCW040256K0JNED)
R76  ValueDisplayed: 0  [0603]  (hidden comment: CRCW06030000Z0EA)
R77  ValueDisplayed: 10.0  [CPF0402]  (hidden comment: CPF0402B10RE1)
R78  ValueDisplayed: 10.0  [CPF0402]  (hidden comment: CPF0402B10RE1)
R79  ValueDisplayed: 2.2k  [0402]  (hidden comment: CRCW04022K20JNED)
R80  ValueDisplayed: 2.2k  [0402]  (hidden comment: CRCW04022K20JNED)
R81  ValueDisplayed: 10.0  [CPF0402]  (hidden comment: CPF0402B10RE1)
R82  ValueDisplayed: 0  [0402]  (hidden comment: CRCW04020000Z0EDHP)
R83  ValueDisplayed: 10.0  [CPF0402]  (hidden comment: CPF0402B10RE1)
R84  ValueDisplayed: 0  [0402]  (hidden comment: CRCW04020000Z0EDHP)
R85  ValueDisplayed: 0  [0603]  (hidden comment: CRCW06030000Z0EA)
R86  ValueDisplayed: 0  [0402]  (hidden comment: CRCW04020000Z0EDHP)
S3  B3U-1100P  [SW_B3U-1100P]  (value not drawn)
S4  Circuit: SPST  [SW_218-2LP]  (hidden comment: 218-2LPST)
TP5  TESTPOINT  [TP_50MIL-25MILHOLE]  (value not drawn)  (no BOM)
TP6  TESTPOINT  [TP_50MIL-25MILHOLE]  (value not drawn)  (no BOM)
TP7  TESTPOINT  [TP_50MIL-25MILHOLE]  (value not drawn)  (no BOM)
TP8  TESTPOINT  [TP_50MIL-25MILHOLE]  (value not drawn)  (no BOM)
TP9  TESTPOINT  [TP_50MIL-25MILHOLE]  (value not drawn)  (no BOM)
TP10  TESTPOINT  [TP_50MIL-25MILHOLE]  (value not drawn)  (no BOM)
U1#1  TMS320F28388DZWTS  [ZWT0337A-IPC_B]  (part C of 5)
U2  SN74LVC2G07DBVR  [DBV0006A_N]
U5  CDCLVC1104PW  [PW0008A_N]
U6  TPS3702CX33DDCT  [DDC0006A_N]
U7  TPS3702CX12DDCT  [DDC0006A_N]
Y1  CMP-0082061-2  [ECS_ECS-2520S]

### Blocks framed on the sheet
LEDs: C73 D3 D4 R66 R67 R69 R70 U2
Reset & Voltage Monitoring: C74-C77 R68 R71 R72 S3 TP6 TP7 U6 U7
Clock Source Selection: R73 R76 R85 TP8-TP10
Boot Mode Selection Switch: R74 R75 R79 R80 S4
25MHz Clock: C78 R77 R78 R81-R84 R86 U5 Y1

### Nets
GND: C73.2 C74.2 C75.2 C76.2 C77.2 C78.2 R62.1 R63.1 R64.1 R79.2 R80.1 R82.2 R86.2 S3.2 S3.3(GND) U2.2(GND) U5.4(GND) U6.2(GND) U7.2(GND) Y1.2(GND)
VDD_1V2: U7.3(SENSE)
VDD_3V3: C73.1 C75.1 C77.1 C78.1 R66.1 R67.1 R68.2 R69.2 R70.2 R71.2 R74.1 R75.2 R84.1 U2.5(VCC) U5.6(VDD) U6.3(SENSE) U6.4(SET) U6.5(VDD) U7.4(SET) U7.5(VDD) Y1.4(VCC)
25MHZ_CLK: U5.1(CLKIN) Y1.3(OUTPUT)
ENET_PHY_CLK: R77.2
ERRORSTS: R64.2 TP5.1 U1#1.U19(ERRORSTS)
F2838x_25MHZ_CLK: R83.2 R85.2
F2838x_CLK: R63.2 R85.1 TP10.1 U1#1.G19(X1)
MCU_GPIO31: R69.1 U2.1(1A)
MCU_GPIO34: R70.1 U2.3(2A)
MCU_GPIO72: R74.2 S4.2
MCU_GPIO84: R75.1 S4.1
MCU_GPIO107: R72.2
MCU_TCK: U1#1.V15(TCK)
MCU_TDI: U1#1.W13(TDI)
MCU_TDO: R59.1
MCU_TMS: U1#1.W14(TMS)
MCU_TRSTn: R62.2 U1#1.V14(~{TRST})
MCU_XRSn: C74.1 R68.1 S3.1 TP6.1 U1#1.F19(~{XRS}) U6.1(~{OUTA}) U7.1(~{OUTA})
P0_25MHZ_CLK: R73.2 R78.2
P0_PHY_CLK: R73.1 TP8.1
P1_25MHZ_CLK: R76.2 R81.2
P1_PHY_CLK: R76.1 TP9.1
NetC76_1: C76.1 R71.1 R72.1 TP7.1 U6.6(~{OUTB}) U7.6(~{OUTB})
NetD3_1: D3.1(K) U2.6(1Y)
NetD3_2: D3.2(A) R66.2
NetD4_1: D4.1(K) U2.4(2Y)
NetD4_2: D4.2(A) R67.2
NetR59_2: R59.2 U1#1.W15(TDO)
NetR77_1: R77.1 U5.3(Y0)
NetR78_1: R78.1 U5.8(Y1)
NetR79_1: R79.1 S4.3
NetR80_2: R80.2 S4.4
NetR81_1: R81.1 U5.5(Y2)
NetR82_1: R82.1 Y1.1(TRI-STATE)
NetR83_1: R83.1 U5.7(Y3)
NetR84_2: R84.2 R86.1 U5.2(1G)

Not connected (* = marked no-connect by the designer): U1#1 H4(NC)* J18(NC)* J19(X2) V13(FLT2) W12(FLT1)

### Layout directives
50 Ohm Impedance: Undefined: ENET_PHY_CLK, F2838x_25MHZ_CLK, P0_25MHZ_CLK, P1_25MHZ_CLK

### Notes on the sheet
- Place near U5

### Library data of the parts
C73 C75 C77 C78 = CMP-0006343-2: CAP, CERM, 0.1 uF, 10 V, +/- 10%, X7R, 0402; Manufacturer: Samsung Electro-Mechanics; Polarized: N; Value: 0.1uF; U/M: EA; Cap_F: 100nF; Value1: Unknown; VDC_V: 10V; TaMin_C: -55°C; TaMax_C: 125°C; AEC Category: Q200; SizeArea_mm2: 0.5; SizeAreaWB_mm2: 3; SizeX_mm: 1; SizeZ_mm: 0.6; CompType: Capacitor; PartNumber: CL05B104KP5NNNC; PackageReference: 0402; RoHS: Y; Tolerance_%: 10%; Value2: 10V; MountType: SMT; Technology: Ceramic; TempCo: X7R; Cap_Case: 0402; Published: 2008-06-19; Publisher: Texas Instruments; LatestRevisionDate: 2017-03-09; ComponentLink1Description: Datasheet link; ComponentLink1URL: http://www.samsungsem.com/kr/front/downloadcms.do?path=/kr/support/product-search/mlcc/__icsFiles/afieldfile/2014/11/05&fileName=S_CL05B104KP5NNNC.pdf; AEC Qualified: N; AEC Grade: N/A; SizeY_mm: 0.5
C74 C76 = CMP-0006236-2: CAP, CERM, 0.01 uF, 50 V, +/- 5%, X7R, 0402; Manufacturer: Kemet; TaMin_C: -55°C; Polarized: N; SizeAreaWB_mm2: 3; Value1: Unknown; U/M: EA; Value: 0.01uF; TaMax_C: 125°C; SizeZ_mm: 0.6; SizeX_mm: 1; SizeY_mm: 0.5; Value2: 50V; Cap_F: 10nF; AEC Category: Q200; Supplier Part Number 2: 57J0044; Publisher: Texas Instruments; Supplier 2: Newark; Supplier Part Number 3: 80-C0402C103J5R; TempCo: X7R; Supplier 3: Mouser; Published: 2008-06-19; RoHS: Y; MountType: SMT; Supplier 1: Digi-Key; PackageReference: 0402; Tolerance_%: 5%; Cap_Case: 0402; SizeArea_mm2: 0.5; CompType: Capacitor; LatestRevisionDate: 2017-03-09; PartNumber: C0402C103J5RACTU; AEC Qualified: ?; ComponentLink1Description: Datasheet link; Supplier Part Number 1: 399-7758-1-ND; Technology: Ceramic; ComponentLink1URL: http://www.kemet.com/Lists/ProductCatalog/Attachments/53/KEM_C1002_X7R_SMD.pdf
D3 = CMP-0002951-3: LED, Red, SMD; Manufacturer: Wurth Elektronik; Type: AlInGaP; Angle: 140; Vr_V: 5V; Ir_A: 25µA; Vf_V: 1.9V; Value1: 0.072W; Tjmax_C: 85°C; Io_A: 30mA; Power_TotalModule: 72mW; CompType: LED; PartNumber: 150080SS75000; Color: Red; MountType: SMT; ComponentLink1URL: http://katalog.we-online.de/led/datasheet/150080SS75000.pdf; PackageReference: LED_0805; ComponentLink1Description: Datasheet link; Value2: 1.9V; RoHS: Y
D4 = CMP-0002951-3: LED, Red, SMD; Manufacturer: Wurth Elektronik; Type: AlInGaP; Vf_V: 1.9V; Io_A: 30mA; Vr_V: 5V; Ir_A: 25µA; Tjmax_C: 85°C; Power_TotalModule: 72mW; Value1: 0.072W; Angle: 140; PartNumber: 150080SS75000; PackageReference: LED_0805; RoHS: Y; CompType: LED; MountType: SMT; Value2: 1.9V; Color: Red; ComponentLink1URL: http://katalog.we-online.de/led/datasheet/150080SS75000.pdf; ComponentLink1Description: Datasheet link
R59 = CMP-0026916-3: as R3 on sheet 1.GPIO; Supplier Part Number 2: 89M6649; Supplier 2: Newark; Supplier Part Number 3: 71-CRCW0402J-39-E3; Supplier 3: Mouser; RoHS: E; Value1: 5%; MountType: SMT; Supplier 1: Digi-Key; PackageReference: 0402; Tolerance_%: 5%; Res_ohm: 39; SizeArea_mm2: 0.5; CompType: Resistor; PartNumber: CRCW040239R0JNED; ComponentLink1Description: Datasheet link; Supplier Part Number 1: 541-39JCT-ND; Technology: Thick Film; ComponentLink1URL: http://www.vishay.com/docs/20035/dcrcwe3.pdf
R62 R63 = CMP-0026890-5: RES, 2.2 k, 5%, 0.063 W, AEC-Q200 Grade 0, 0402; Manufacturer: Vishay-Dale; Power_W: 63mW; TempCo: 200 ppm/C; Value_Code: 2k20; Value: 2.2k; EIA_Code: E24; SizeX_mm: 1; SizeY_mm: 0.5; SizeZ_mm: 0.6; Value2: 0.063W; AEC Qualified: Y; VDC_V: 50V; AEC Category: Q200; AEC Grade: 0; Supplier Part Number 2: 59M6710; Supplier 2: Newark; Supplier Part Number 3: 71-CRCW0402J-2.2K-E3; Supplier 3: Mouser; RoHS: E; Value1: 5%; MountType: SMT; Supplier 1: Digi-Key; PackageReference: 0402; Tolerance_%: 5%; Res_ohm: 2.2k; SizeArea_mm2: 0.5; CompType: Resistor; PartNumber: CRCW04022K20JNED; ComponentLink1Description: Datasheet link; Supplier Part Number 1: 541-2.2KJCT-ND; Technology: Thick Film; ComponentLink1URL: http://www.vishay.com/docs/20035/dcrcwe3.pdf
R64 = CMP-0078669-1: RES, 10.0 k, 1%, 0.063 W, 0402; Manufacturer: Yageo America; Power_W: 63mW; Green_Lifecycle: Active; TempCo: 100 ppm/C; Value_Code: 10k0; Green_REACh: Passed; Value: 10.0k; EIA_Code: E96; Res_ohm: 10k; SizeX_mm: 1; SizeY_mm: 0.5; SizeZ_mm: 0.6; Value2: 0.063W; AEC Qualified: N; AEC Category: Q200; ComponentLink1URL: http://www.yageo.com/documents/recent/PYu-RC_Group_51_RoHS_L_8.pdf; Supplier Part Number 2: 98K7499; Supplier 2: Newark; Supplier Part Number 3: 603-RC0402FR-0710KL; Supplier 3: Mouser; RoHS: Y; Value1: 1%; MountType: SMT; Green_EU RoHS-2: Passed; Supplier 1: Digi-Key; Green_EU RoHS: Passed with Exemption; PackageReference: 0402; Tolerance_%: 1%; SizeArea_mm2: 0.5; CompType: Resistor; PartNumber: RC0402FR-0710KL; ComponentLink1Description: Datasheet link; AEC Grade: N/A; Supplier Part Number 1: 311-10.0KLRCT-ND; Technology: Thick Film
R66 R67 = CMP-0026962-3: RES, 680, 5%, 0.063 W, AEC-Q200 Grade 0, 0402; Manufacturer: Vishay-Dale; Value: 680; Value_Code: 680R; Power_W: 63mW; Value2: 0.063W; VDC_V: 50V; TempCo: 200 ppm/C; EIA_Code: E24; AEC Category: Q200; AEC Qualified: Y; AEC Grade: 0; SizeArea_mm2: 0.5; SizeX_mm: 1; SizeZ_mm: 0.6; CompType: Resistor; PartNumber: CRCW0402680RJNED; PackageReference: 0402; RoHS: E; Res_ohm: 680; Tolerance_%: 5%; Value1: 5%; MountType: SMT; Technology: Thick Film; ComponentLink1Description: Datasheet link; ComponentLink1URL: http://www.vishay.com/docs/20035/dcrcwe3.pdf; Supplier 1: Digi-Key; Supplier Part Number 1: 541-680JCT-ND; Supplier 2: Newark; Supplier Part Number 2: 59M6744; Supplier 3: Mouser; Supplier Part Number 3: 71-CRCW0402J-680-E3; SizeY_mm: 0.5
R68 R71 R79 R80 = CMP-0026890-5: RES, 2.2 k, 5%, 0.063 W, AEC-Q200 Grade 0, 0402; Manufacturer: Vishay-Dale; Value: 2.2k; Value_Code: 2k20; Power_W: 63mW; Value2: 0.063W; VDC_V: 50V; TempCo: 200 ppm/C; EIA_Code: E24; AEC Category: Q200; AEC Qualified: Y; AEC Grade: 0; SizeArea_mm2: 0.5; SizeX_mm: 1; SizeZ_mm: 0.6; CompType: Resistor; PartNumber: CRCW04022K20JNED; PackageReference: 0402; RoHS: E; Res_ohm: 2.2k; Tolerance_%: 5%; Value1: 5%; MountType: SMT; Technology: Thick Film; ComponentLink1Description: Datasheet link; ComponentLink1URL: http://www.vishay.com/docs/20035/dcrcwe3.pdf; Supplier 1: Digi-Key; Supplier Part Number 1: 541-2.2KJCT-ND; Supplier 2: Newark; Supplier Part Number 2: 59M6710; Supplier 3: Mouser; Supplier Part Number 3: 71-CRCW0402J-2.2K-E3; SizeY_mm: 0.5
R69 R70 = CMP-0026863-2: RES, 1.5 M, 5%, 0.063 W, AEC-Q200 Grade 0, 0402; Manufacturer: Vishay-Dale; Power_W: 63mW; TempCo: 200 ppm/C; Value_Code: 1M50; Value: 1.5Meg; EIA_Code: E24; SizeX_mm: 1; SizeY_mm: 0.5; SizeZ_mm: 0.6; Value2: 0.063W; AEC Qualified: Y; VDC_V: 50V; AEC Category: Q200; AEC Grade: 0; ComponentLink1URL: http://www.vishay.com/docs/20035/dcrcwe3.pdf; Supplier Part Number 2: 71-CRCW04021M50JNED; Supplier 2: Mouser; RoHS: E; Value1: 5%; MountType: SMT; Supplier 1: Digi-Key; PackageReference: 0402; Tolerance_%: 5%; Res_ohm: 1.5M; SizeArea_mm2: 0.5; CompType: Resistor; PartNumber: CRCW04021M50JNED; ComponentLink1Description: Datasheet link; Supplier Part Number 1: 541-1.5MJCT-ND; Technology: Thick Film
R72 R73 R76 R85 = CMP-0025697-4: RES, 0, 5%, 0.1 W, AEC-Q200 Grade 0, 0603; Manufacturer: Vishay-Dale; Value: 0; Value_Code: 0000; Power_W: 100mW; Value2: 0.1W; VDC_V: 75V; TempCo: 200 ppm/C; EIA_Code: E24; AEC Category: Q200; AEC Qualified: Y; SizeArea_mm2: 1.28; SizeX_mm: 1.6; SizeY_mm: 0.8; SizeZ_mm: 1; CompType: Resistor; PartNumber: CRCW06030000Z0EA; PackageReference: 0603; RoHS: E; Res_ohm: 0; Tolerance_%: 5%; Value1: 5%; MountType: SMT; Technology: Thick Film; ComponentLink1Description: Datasheet link; ComponentLink1URL: http://www.vishay.com/docs/20035/dcrcwe3.pdf; Supplier 1: Digi-Key; Supplier Part Number 1: 541-0.0GCT-ND; Supplier 2: Newark; Supplier Part Number 2: 52K8014; Supplier 3: Mouser; Supplier Part Number 3: 71-CRCW0603-0-E3; AEC Grade: 0
R74 R75 = CMP-0026949-3: RES, 56 k, 5%, 0.063 W, AEC-Q200 Grade 0, 0402; Manufacturer: Vishay-Dale; Value: 56k; Value_Code: 56k0; Power_W: 63mW; Value2: 0.063W; VDC_V: 50V; TempCo: 200 ppm/C; EIA_Code: E24; AEC Category: Q200; AEC Qualified: Y; AEC Grade: 0; SizeArea_mm2: 0.5; SizeX_mm: 1; SizeZ_mm: 0.6; CompType: Resistor; PartNumber: CRCW040256K0JNED; PackageReference: 0402; RoHS: E; Res_ohm: 56k; Tolerance_%: 5%; Value1: 5%; MountType: SMT; Technology: Thick Film; ComponentLink1Description: Datasheet link; ComponentLink1URL: http://www.vishay.com/docs/20035/dcrcwe3.pdf; Supplier 1: Digi-Key; Supplier Part Number 1: 541-56KJCT-ND; Supplier 2: Newark; Supplier Part Number 2: 89M6680; Supplier 3: Mouser; Supplier Part Number 3: 71-CRCW0402J-56K-E3; SizeY_mm: 0.5
R77 R78 R81 R83 = CMP-0026765-1: RES, 10.0, 0.1%, 0.063 W, 0402; Manufacturer: TE Connectivity; Power_W: 63mW; TempCo: 25 ppm/C; Value_Code: 10R0; U/M: EA; Value: 10.0; EIA_Code: E192; Res_ohm: 10; SizeX_mm: 1; SizeY_mm: 0.5; SizeZ_mm: 0.35; Value2: 0.063W; AEC Qualified: N; AEC Category: Q200; ComponentLink1URL: http://www.te.com/commerce/DocumentDelivery/DDEController?Action=srchrtrv&DocNm=1773200&DocType=DS&DocLang=English; Supplier Part Number 2: 80P3855; Publisher: Texas Instruments; Supplier 2: Newark; Supplier Part Number 3: 279-CPF0402B10RE1; Supplier 3: Mouser; Published: 2008-06-26; RoHS: Y; Value1: 0.1%; MountType: SMT; Supplier 1: Digi-Key; PackageReference: 0402; Tolerance_%: 0.1%; SizeArea_mm2: 0.5; CompType: Resistor; LatestRevisionDate: 2017-03-09; PartNumber: CPF0402B10RE1; ComponentLink1Description: Datasheet link; AEC Grade: N/A; Supplier Part Number 1: A102583CT-ND; Technology: Thin Film
R82 R84 R86 = CMP-0081856-1: RES, 0, 0%, 0.2 W, AEC-Q200 Grade 0, 0402; Manufacturer: Vishay-Dale; SizeAreaWB_mm2: 3; SizeArea_mm2: 0.5; AEC Qualified: Y; AEC Category: Q200; Value: 0; SizeZ_mm: 0.6; Power_W: 200mW; VDC_V: 50V; Value2: 0.2W; SizeX_mm: 1; ComponentLink1Description: Datasheet link; RoHS: Y; Supplier Part Number 3: 71-CRCW04020000Z0EDH; Tolerance_%: 0%; Value_Code: 0; Supplier 1: Digi-Key; PackageReference: 0402; Technology: Thick Film; Res_ohm: 0; PartNumber: CRCW04020000Z0EDHP; Supplier Part Number 2: 96Y9050; Supplier 2: Newark; AEC Grade: 0; SizeY_mm: 0.5; ComponentLink1URL: http://www.vishay.com/docs/20043/crcwhpe3.pdf; Value1: 0%; CompType: Resistor; MountType: SMT; Supplier Part Number 1: 541-0.0YBTR-ND; Supplier 3: Mouser
S3 = CMP-0002193-2: Switch, SPST-NO, Off-Mom, 12 V, SMD; Manufacturer: Omron Electronic Components; CurrentRating_mA: 50A; PositionCount: 1; VDC_V: 12V; Supplier 2: Newark; Supplier 3: Mouser; Supplier 1: Digi-Key; Supplier Part Number 1: SW1021CT-ND; Supplier Part Number 2: 39M4619; Supplier Part Number 3: 653-B3U-1100P; PartNumber: B3U-1100P; ComponentLink1Description: Datasheet URL; LatestRevisionDate: 2017-03-09; CompType: Switch; Publisher: Texas Instruments; Circuit: SPST-NO; RoHS: Y; Orientation: Top Actuated; SwitchFunction: Off-Mom; PackageReference: SMD, 3-Leads, Body 3x2.5mm; MountType: SMT; ComponentLink1URL: http://www.omron.com/ecb/products/pdf/en-b3u.pdf
S4 = CMP-0002230-1: Switch, SPST, 2 Pos, 25mA, 24VDC, SMD; Manufacturer: CTS Electrocomponents; VDC_V: 24V; SwitchFunction: Off-On; PositionCount: 2; CurrentRating_mA: 25A; PartNumber: 218-2LPST; MountType: SMT; ComponentLink1Description: Datasheet Link; ComponentLink1URL: http://www.ctscorp.com/components/Datasheets/218.pdf; RoHS: Y; Orientation: Top Actuated; CompType: Switch; PackageReference: 3.71x5.8mm; Publisher: Texas Instruments; LatestRevisionDate: 2017-03-09; Supplier 1: Digi-Key; Supplier Part Number 1: CT2182LPST-ND; Supplier 2: Mouser; Supplier Part Number 2: 774-2182LPST
TP5-TP10 = CMP-0078143-3: TEST POINT.  No entry in BOM.; CompType: Testpoint; PackageReference: N/A; Manufacturer: N/A; PartNumber: N/A; Library Reference: TESTPOINT
U1#1 = CMP-012-000147-1: TMS320F28388DZWTS, ZWT0337A (NFBGA-337); Alternate Manufacturer: Texas Instruments; SizeY_mm: 16; SizeArea_mm2: 256; AEC Qualified: N; SizeAreaWB_mm2: 324; SizeZ_mm: 1.4; Available Preview Images: 2D; CompType: IC; AEC Category: Q200; ComponentLink2URL: http://www.ti.com/product/tms320f28388d; MountType: SMT; ComponentLink3Description: Online Datasheet; PackageDescription: NFBGA-337; ComponentLink3URL: http://www.ti.com/product/tms320f28388d/datasheet; SizeX_mm: 16; Design Item ID: TMS320F28388DZWTS; ComponentLink1URL: http://www.ti.com/lit/ds/symlink/tms320f28388d.pdf; Source: SamacSys.SchLib; ComponentLink2Description: Product Folder; PackageReference: ZWT0337A; Manufacturer: Texas Instruments; ComponentLink1Description: Datasheet Link
U2 = CMP-0051789-2: Dual Buffer/Driver with Open-Drain Output, DBV0006A, LARGE T&R; Manufacturer: Texas Instruments; 3-State Output: No; Bits(#): 2; F @ Nom Voltage(Max)(Mhz): 150; ICC @ Nom Voltage(Max)(mA): 0.01; Input Type: CMOS/TTL; Logic: True; Output Drive (IOL/IOH)(Max)(mA): 32/-32; Output Type: CMOS; Rating: Catalog; Sub-Family: Inverting Buffer/Driver; Technology Family: LVC; tpd @ Nom Voltage(Max)(ns): 8.6,4.4,3.7,2.9; VCC(Max)(V): 5.5; VCC(Min)(V): 1.65; Voltage(Nom)(V): 1.8,2.5,3.3,5; AEC Category: Q200; AEC Qualified: N; CompType: IC; Green_Lifecycle: Active; Green_REACh: Passed; SizeArea_mm2: 8.12; SizeAreaWB_mm2: 14.82; SizeX_mm: 2.8; SizeY_mm: 2.9; SizeZ_mm: 1.45; PackageReference: DBV0006A; DatasheetVersion: SCES308K; Generic Part Number: SN74LVC2G07; Operating Temperature Range(C): -40 to 125; Schmitt Trigger: No; ComponentLink1Description: Datasheet Link; ComponentLink1URL: http://www.ti.com/lit/ds/symlink/sn74lvc2g07.pdf; ComponentLink2Description: Product Folder; ComponentLink2URL: http://www.ti.com/product/sn74lvc2g07; ComponentLink3Description: Online Datasheet; ComponentLink3URL: http://www.ti.com/product/sn74lvc2g07/datasheet; Green_EU RoHS-2: Passed; Green_EU RoHS: Passed; MountType: SMT; PackageDescription: SOT-23-6; PartNumber: SN74LVC2G07DBVR; RoHS: Y
U5 = CMP-052-000006-1: Low Jitter, 1:4 LVCMOS Fan-out Clock Buffer, PW0008A (TSSOP-8); Manufacturer: Texas Instruments; Green_REACh: Passed; SizeArea_mm2: 19.2; SizeY_mm: 3.0; SizeX_mm: 6.4; Available Preview Images: 2D; SizeZ_mm: 1.2; Green_Lifecycle: Active; SizeAreaWB_mm2: 42.0; U/M: EA; CompType: IC; PackageReference: PW0008A; ComponentLink1Description: Datasheet Link; Publisher: Texas Instruments; PartNumber: CDCLVC1104PW; PackageDescription: TSSOP-8; RoHS: Y; Design Item ID: CDCLVC1104PW; Source: MCU063B.SCHLIB; Green_EU RoHS: Passed; MountType: SMT; Alternate Manufacturer: Texas Instruments; ComponentLink1URL: http://www.ti.com/lit/ds/symlink/cdclvc1104.pdf; Green_EU RoHS-2: Passed; LatestRevisionDate: 2017-06-09
U6 U7 = CMP-052-000005-1: High-Accuracy, Fixed-Threshold OV/UV Monitor, DDC0006A (SOT-23-T-6); Alternate PartNumber: TPS3702CX33DDCR; Alternate Manufacturer: Texas Instruments; SizeX_mm: 1.65; SizeY_mm: 2.95; SizeArea_mm2: 4.8675; SizeZ_mm: 0.87; SizeAreaWB_mm2: 10.4675; AEC Qualified: N; CompType: IC; Available Preview Images: 2D; AEC Category: Q200; Source: MCU063B.SCHLIB; ComponentLink2URL: http://www.ti.com/product/tps3702; RoHS: Y; ComponentLink3Description: Online Datasheet; ComponentLink3URL: http://www.ti.com/product/tps3702/datasheet; PackageDescription: SOT-23-T-6; MountType: SMT; ComponentLink1Description: Datasheet Link; Design Item ID: TPS3702CX33DDCT; PackageReference: DDC0006A; ComponentLink1URL: http://www.ti.com/lit/ds/symlink/tps3702.pdf; ComponentLink2Description: Product Folder; Manufacturer: Texas Instruments
  U6: PartNumber: TPS3702CX33DDCT
  U7: PartNumber: TPS3702CX12DDCT
Y1 = CMP-052-000000-1: Oscillator, 25 MHz, 15 pF, SMD; Manufacturer: ECS Inc.; PartNumber: ECS-2520S33-250-FN-TR; SizeZ_mm: 1; SizeY_mm: 2.5; SizeX_mm: 2; Load Capacitance: 15pF; AEC Qualified: N; Available Preview Images: 2D; Frequency Stability: 10 ppm; TaMin_C: -40°C; Frequency_Fixed: 25MHz; SizeAreaWB_mm2: 10.5; TaMax_C: 85°C; AEC Category: Q200; SizeArea_mm2: 5; Design Item ID: CMP-0082061-2; CompType: Oscillator; Source: MCU063B.SCHLIB; RoHS: Y; ComponentLink1Description: Datasheet Link; PackageReference: 2x2.5mm; ComponentLink1URL: https://www.ecsxtal.com/store/pdf/ECS-2520S.pdf; AEC Grade: N/A; MountType: SMT